# EasyEDA schematic PMD_PROJECT_var2.json
TITLE: 8086; REV: 1.0; Date: 2023-11-04; Sheet: 1/1; Company: Turcin
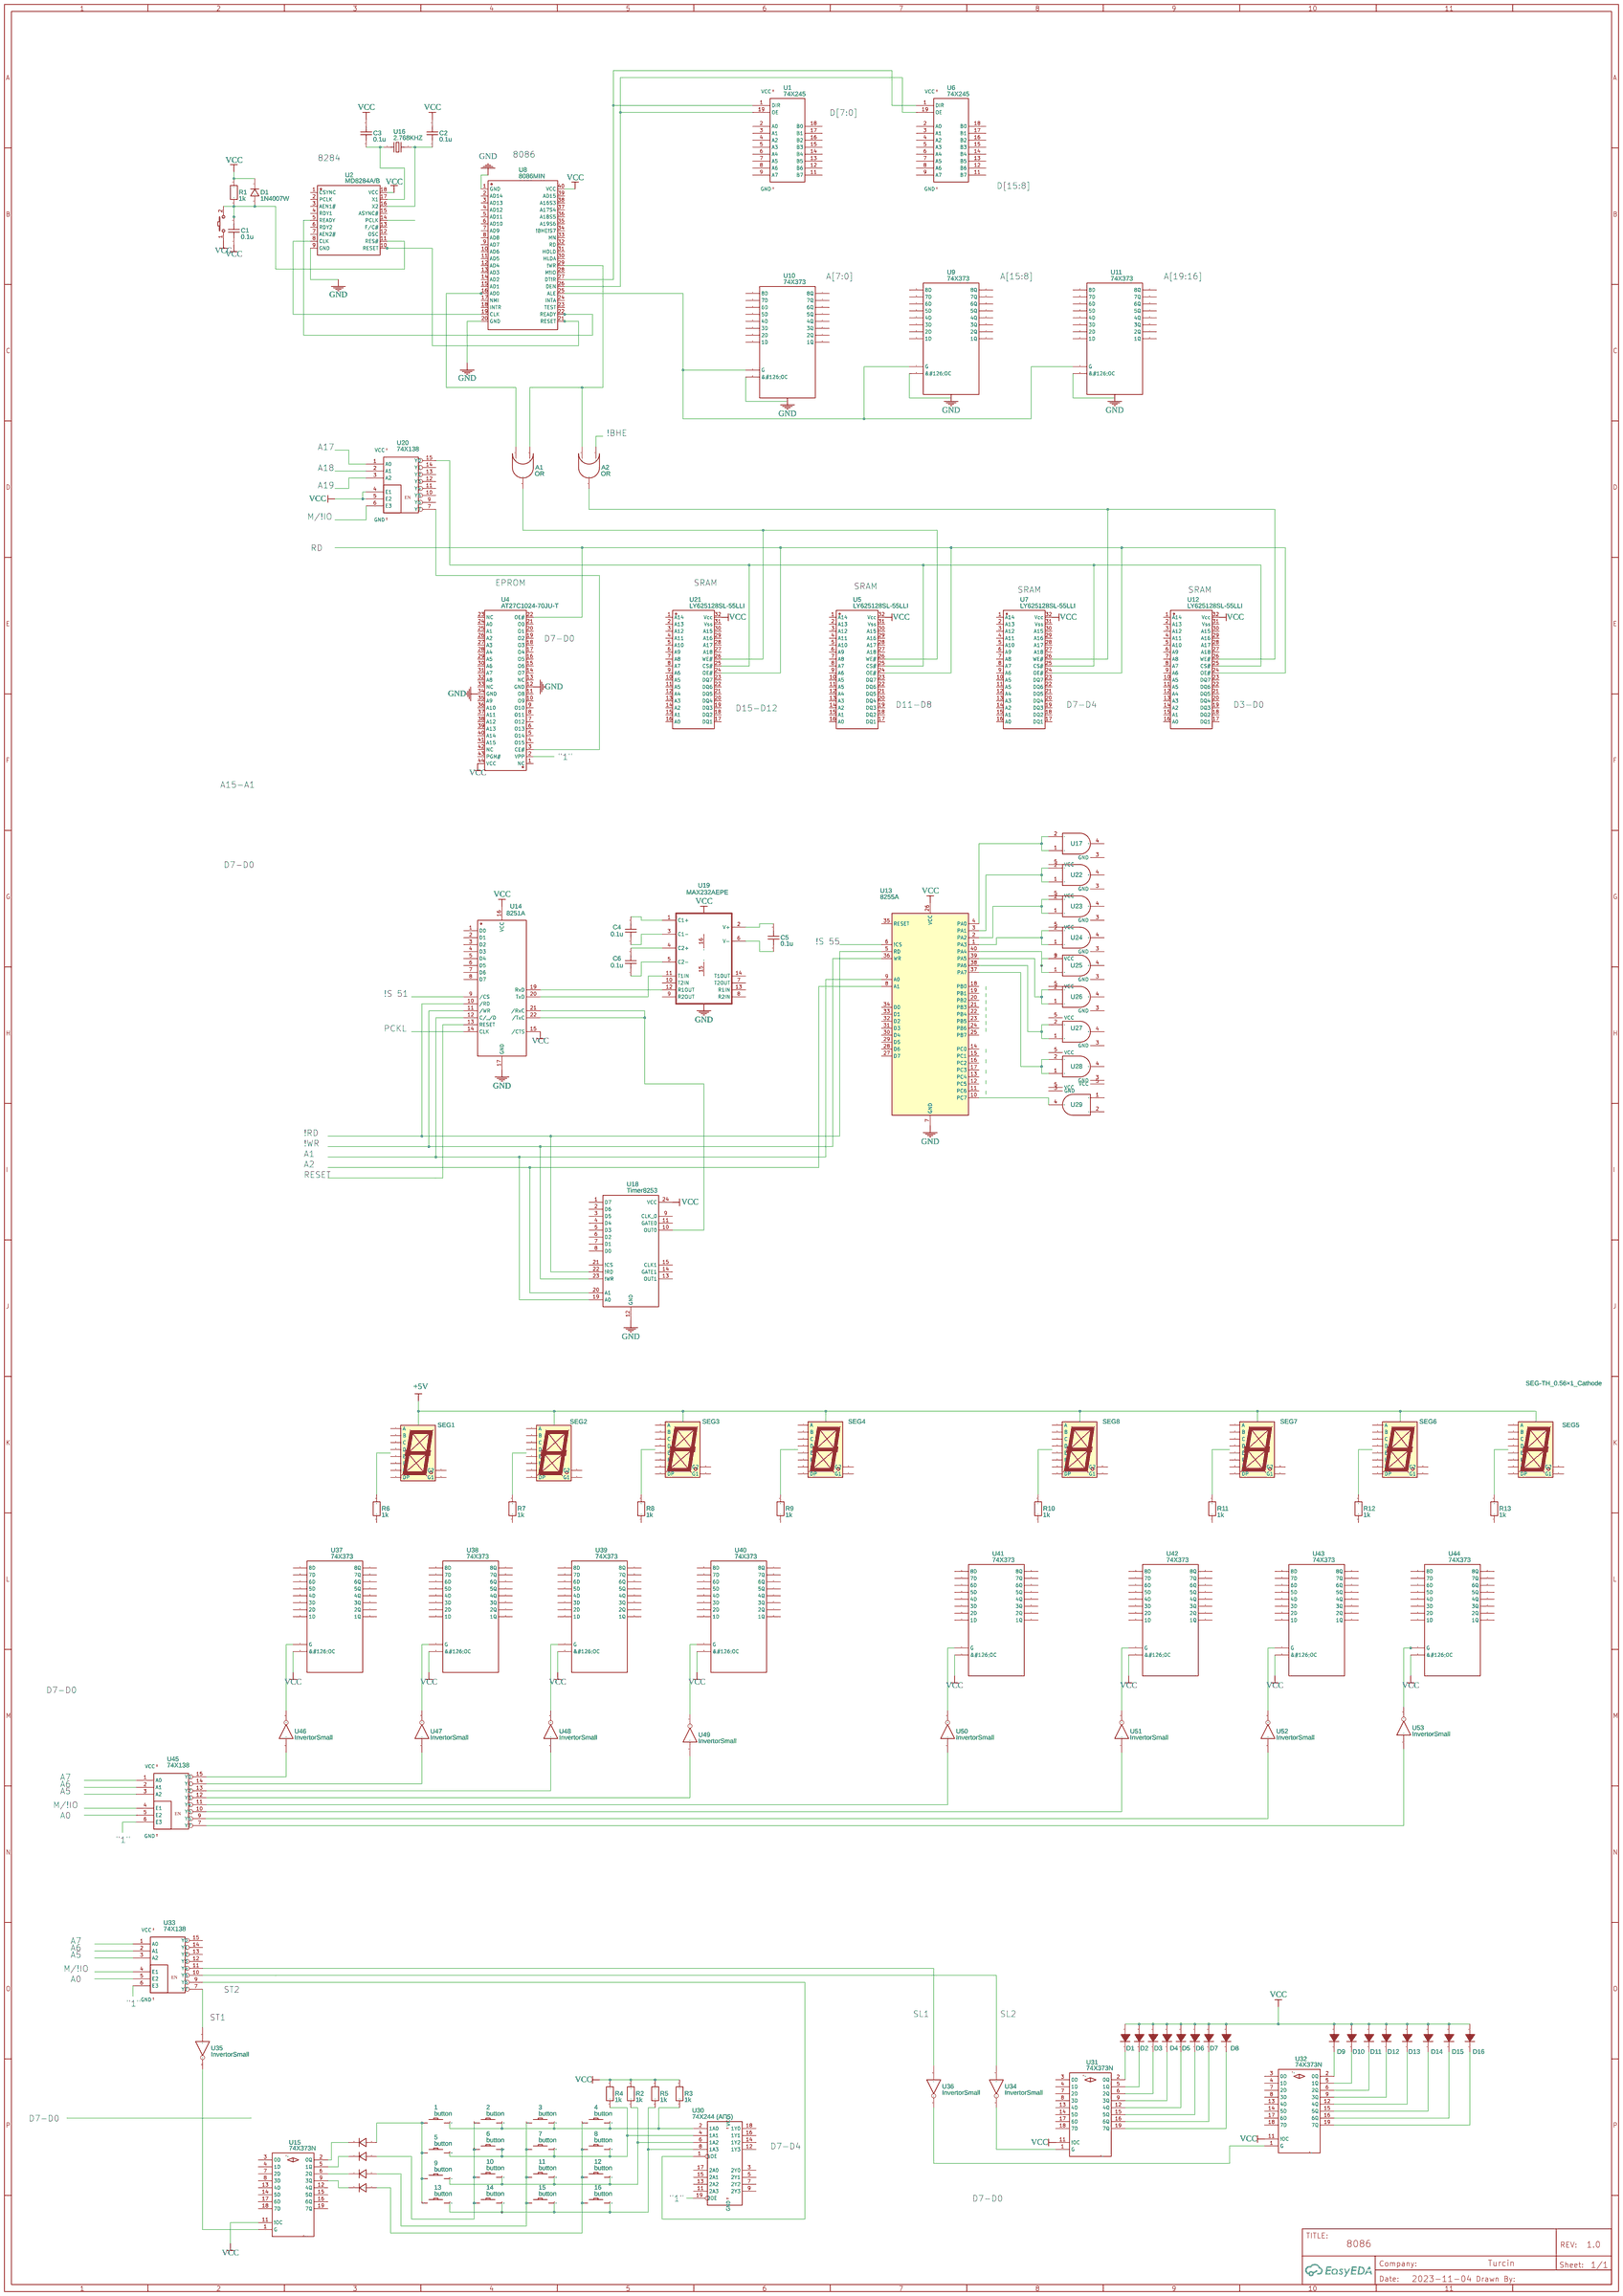
[diagram p0: schematic sheet]

## Parts
1  button  [32TEETH---CONDUCTIVE-BUTTONS_CONDUCTIVE_BUTTON_DIRECTIONAL_THICK]
2  button  [32TEETH---CONDUCTIVE-BUTTONS_CONDUCTIVE_BUTTON_DIRECTIONAL_THICK]
3  button  [32TEETH---CONDUCTIVE-BUTTONS_CONDUCTIVE_BUTTON_DIRECTIONAL_THICK]
4  button  [32TEETH---CONDUCTIVE-BUTTONS_CONDUCTIVE_BUTTON_DIRECTIONAL_THICK]
5  button  [32TEETH---CONDUCTIVE-BUTTONS_CONDUCTIVE_BUTTON_DIRECTIONAL_THICK]
6  button  [32TEETH---CONDUCTIVE-BUTTONS_CONDUCTIVE_BUTTON_DIRECTIONAL_THICK]
7  button  [32TEETH---CONDUCTIVE-BUTTONS_CONDUCTIVE_BUTTON_DIRECTIONAL_THICK]
8  button  [32TEETH---CONDUCTIVE-BUTTONS_CONDUCTIVE_BUTTON_DIRECTIONAL_THICK]
9  button  [32TEETH---CONDUCTIVE-BUTTONS_CONDUCTIVE_BUTTON_DIRECTIONAL_THICK]
10  button  [32TEETH---CONDUCTIVE-BUTTONS_CONDUCTIVE_BUTTON_DIRECTIONAL_THICK]
11  button  [32TEETH---CONDUCTIVE-BUTTONS_CONDUCTIVE_BUTTON_DIRECTIONAL_THICK]
12  button  [32TEETH---CONDUCTIVE-BUTTONS_CONDUCTIVE_BUTTON_DIRECTIONAL_THICK]
13  button  [32TEETH---CONDUCTIVE-BUTTONS_CONDUCTIVE_BUTTON_DIRECTIONAL_THICK]
14  button  [32TEETH---CONDUCTIVE-BUTTONS_CONDUCTIVE_BUTTON_DIRECTIONAL_THICK]
15  button  [32TEETH---CONDUCTIVE-BUTTONS_CONDUCTIVE_BUTTON_DIRECTIONAL_THICK]
16  button  [32TEETH---CONDUCTIVE-BUTTONS_CONDUCTIVE_BUTTON_DIRECTIONAL_THICK]
A1  OR
A2  OR
C1  0.1u  [C0603]
C2  0.1u  [C0603]
C3  0.1u  [C0603]
C4  0.1u  [C0603]
C5  0.1u  [C0603]
C6  0.1u  [C0603]
D1  1N4007W  [SOD-123_L2.8-W1.8-LS3.7-RD]
D1#2  diode led  [DO-41 (1N4007)_BD2.4-L4.7-P8.70-D0.9-RD]
D2  1N4007W  [SOD-123_L2.8-W1.8-LS3.7-RD]
D2#2  diode led  [DO-41 (1N4007)_BD2.4-L4.7-P8.70-D0.9-RD]
D3  1N4007W  [SOD-123_L2.8-W1.8-LS3.7-RD]
D3#2  diode led  [DO-41 (1N4007)_BD2.4-L4.7-P8.70-D0.9-RD]
D4  1N4007W  [SOD-123_L2.8-W1.8-LS3.7-RD]
D4#2  diode led  [DO-41 (1N4007)_BD2.4-L4.7-P8.70-D0.9-RD]
D5  1N4007W  [SOD-123_L2.8-W1.8-LS3.7-RD]
D5#2  diode led  [DO-41 (1N4007)_BD2.4-L4.7-P8.70-D0.9-RD]
D6  diode led  [DO-41 (1N4007)_BD2.4-L4.7-P8.70-D0.9-RD]
D7  diode led  [DO-41 (1N4007)_BD2.4-L4.7-P8.70-D0.9-RD]
D8  diode led  [DO-41 (1N4007)_BD2.4-L4.7-P8.70-D0.9-RD]
D9  diode led  [DO-41 (1N4007)_BD2.4-L4.7-P8.70-D0.9-RD]
D10  diode led  [DO-41 (1N4007)_BD2.4-L4.7-P8.70-D0.9-RD]
D11  diode led  [DO-41 (1N4007)_BD2.4-L4.7-P8.70-D0.9-RD]
D12  diode led  [DO-41 (1N4007)_BD2.4-L4.7-P8.70-D0.9-RD]
D13  diode led  [DO-41 (1N4007)_BD2.4-L4.7-P8.70-D0.9-RD]
D14  diode led  [DO-41 (1N4007)_BD2.4-L4.7-P8.70-D0.9-RD]
D15  diode led  [DO-41 (1N4007)_BD2.4-L4.7-P8.70-D0.9-RD]
D16  diode led  [DO-41 (1N4007)_BD2.4-L4.7-P8.70-D0.9-RD]
KEY1  K2-3.6×6.1_SMD  [KEY-SMD_2P-L6.2-W3.6-LS8.0]
R1  1k  [R0603]
R2  1k  [R0603]
R3  1k  [R0603]
R4  1k  [R0603]
R5  1k  [R0603]
R6  1k  [R0603]
R7  1k  [R0603]
R8  1k  [R0603]
R9  1k  [R0603]
R10  1k  [R0603]
R11  1k  [R0603]
R12  1k  [R0603]
R13  1k  [R0603]
SEG1  SEG-TH_0.56×1_Cathode  [LED-SEG-TH_10P-L12.6-W19.0-P2.54-S15.24-BL]
SEG2  SEG-TH_0.56×1_Cathode  [LED-SEG-TH_10P-L12.6-W19.0-P2.54-S15.24-BL]
SEG3  SEG-TH_0.56×1_Cathode  [LED-SEG-TH_10P-L12.6-W19.0-P2.54-S15.24-BL]
SEG4  SEG-TH_0.56×1_Cathode  [LED-SEG-TH_10P-L12.6-W19.0-P2.54-S15.24-BL]
SEG5  SEG-TH_0.56×1_Cathode  [LED-SEG-TH_10P-L12.6-W19.0-P2.54-S15.24-BL]
SEG6  SEG-TH_0.56×1_Cathode  [LED-SEG-TH_10P-L12.6-W19.0-P2.54-S15.24-BL]
SEG7  SEG-TH_0.56×1_Cathode  [LED-SEG-TH_10P-L12.6-W19.0-P2.54-S15.24-BL]
SEG8  SEG-TH_0.56×1_Cathode  [LED-SEG-TH_10P-L12.6-W19.0-P2.54-S15.24-BL]
U1  74X245  [IC20]
U2  MD8284A/B  [CDIP-18_L24.4-W6.5-P2.54-LS7.6-BL]
U4  AT27C1024-70JU-T  [PLCC-44_L16.6-W16.6-P1.27-LS17.5-T]
U5  LY625128SL-55LLI  [SOP-32_L20.7-W11.3-P1.27-LS14.1-BL]
U6  74X245  [IC20]
U7  LY625128SL-55LLI  [SOP-32_L20.7-W11.3-P1.27-LS14.1-BL]
U8  8086MIN  [DIP40]
U9  74X373
U10  74X373
U11  74X373
U12  LY625128SL-55LLI  [SOP-32_L20.7-W11.3-P1.27-LS14.1-BL]
U13  8255A  [DIP-40_W15.24MM]
U14  8251A  [COMM-TH_CTM8251AT]
U15  74X373N  [DIP20]
U16  2.768KHZ  [CRYSTAL-SMD_L3.2-W1.5-1]
U17  HD74LV1G08AVS  [PUSN0005KA-A]
U18  Timer8253  [DIP-24__600]
U19  MAX232AEPE  [DIP-16_L20.0-W6.4-P2.54-LS7.6-BL]
U20  74X138  [IC16]
U21  LY625128SL-55LLI  [SOP-32_L20.7-W11.3-P1.27-LS14.1-BL]
U22  HD74LV1G08AVS  [PUSN0005KA-A]
U23  HD74LV1G08AVS  [PUSN0005KA-A]
U24  HD74LV1G08AVS  [PUSN0005KA-A]
U25  HD74LV1G08AVS  [PUSN0005KA-A]
U26  HD74LV1G08AVS  [PUSN0005KA-A]
U27  HD74LV1G08AVS  [PUSN0005KA-A]
U28  HD74LV1G08AVS  [PUSN0005KA-A]
U29  HD74LV1G08AVS  [PUSN0005KA-A]
U30  74X244 (АП5)  [DIP20]
U31  74X373N  [DIP20]
U32  74X373N  [DIP20]
U33  74X138  [IC16]
U34  InvertorSmall
U35  InvertorSmall
U36  InvertorSmall
U37  74X373
U38  74X373
U39  74X373
U40  74X373
U41  74X373
U42  74X373
U43  74X373
U44  74X373
U45  74X138  [IC16]
U46  InvertorSmall
U47  InvertorSmall
U48  InvertorSmall
U49  InvertorSmall
U50  InvertorSmall
U51  InvertorSmall
U52  InvertorSmall
U53  InvertorSmall

## Library data of the parts
1-16 = button: Contributor: LorenzoVonMatterhorn
A1 A2 = OR: Contributor: Marco Micheletto
C1-C6 = C_0603_US: Contributor: LCEDA_Lib
D1-D5 = 1N4007W: Supplier: LCSC; Supplier Part: C328592; Manufacturer: BLUE ROCKET; Contributor: LCEDA_Lib
D1#2 D2#2 D3#2 D4#2 D5#2 D6-D16 = diode led: Manufacturer: ST(先科); Manufacturer Part: 1N4007; Supplier Part: C106903; JLCPCB Part Class: Extended Part; Contributor: remnow99
KEY1 = K2-3.6×6.1_SMD: Supplier Part: C118141; Supplier: LCSC; Manufacturer Part: K2-1107ST-A4SW-06; Contributor: LCEDA_Lib; 制造商: 韩国韩荣
R1-R13 = R_0603_EU: Contributor: LCEDA_Lib
SEG1-SEG8 = SEG-TH_0.56×1_Cathode: Manufacturer: 志浩; Supplier Part: C8093; Contributor: LCEDA_01
U1 U6 = 74X245: Contributor: KiCad
U2 = MD8284A/B: Contributor: lcsc; Supplier: LCSC; Supplier Part: C3610662; Manufacturer: 罗彻斯特; link: https://lcsc.com/eda_search?q=C3610662&%26type=1&ref=editor
U4 = AT27C1024-70JU-T: Contributor: LCSC; Supplier: LCSC; Supplier Part: C2061096; Manufacturer: MICROCHIP(美国微芯); JLCPCB Part Class: Extended Part; link: https://lcsc.com/eda_search?q=C2061096&%26type=1&ref=editor
U5 U7 U12 U21 = LY625128SL-55LLI: Contributor: LCSC; Supplier: LCSC; Supplier Part: C261870; Manufacturer: Lyontek(来扬); JLCPCB Part Class: Extended Part; link: https://lcsc.com/eda_search?q=C261870&%26type=1&ref=editor
U8 = 8086MIN
U9-U11 U37-U44 = 74X373: Contributor: ioana
U13 = 8255A: Contributor: Aptoime TV
U14 = 8251A: Supplier: LCSC; Supplier Part: C404254; Manufacturer: Tsiko; Manufacturer Part: CTM8251AT; Contributor: Cristina Nicolae
U15 U31 U32 = 74X373N: Octal Transparent Latch with 3-State Outputs; Manufacturer Part: 74X373; Contributor: mircioaga iulia
U16 = 2.768KHZ: Contributor: lcsc; Supplier: LCSC; Supplier Part: C9900022434; Manufacturer: null; Manufacturer Part: 2.768KHz; JLCPCB Part Class: Extended Part; link: https://lcsc.com/eda_search?q=C9900022434&%26type=1&ref=editor
U17 U22-U29 = HD74LV1G08AVS: 2-Input AND Gate
U18 = Timer8253: Supplier Part: P8253; Manufacturer: INTEL; Manufacturer Part: P8253; Contributor: Radu_matei; link: https://pdf1.alldatasheet.com/datasheet-pdf/view/66100/INTEL/P8253.html
U19 = MAX232AEPE: Supplier: LCSC; Manufacturer: MAXIM; Supplier Part: C9942; link: https://lcsc.com/eda_search?q=C9942&%26type=1&ref=editor
U20 U33 U45 = 74X138: Contributor: KiCad
U30 = 74X244 (АП5): Contributor: KiCad
U34-U36 U46-U53 = LOGIC: Contributor: Bilal Khan; sim: true

## Nets
GND: U2.9(GND) U4.12(GND) U4.34(GND) U8.1(GND) U8.20(GND) U13.7(GND) U14.17(GND) U18.12(GND)
VCC: C1.1 C2.2 C3.2 D1.1 D1#2.1(A) D2#2.1(A) D3#2.1(A) D4#2.1(A) D5#2.1(A) D6.1(A) D7.1(A) D8.1(A) D9.1(A) D10.1(A) D11.1(A) D12.1(A) D13.1(A) D14.1(A) D15.1(A) D16.1(A) KEY1.1 R1.2 R2.2 R3.2 R4.2 R5.2 U2.18(VCC) U4.44(VCC) U5.32(Vcc) U7.32(Vcc) U8.40(VCC) U12.32(Vcc) U13.26(VCC) U14.15(/CTS) U14.16(VCC) U15.11(!OC) U18.24(VCC) U20.4(E1) U20.5(E2) U21.32(Vcc) U31.11(!OC) U32.11(!OC) U37.18(&#126;OC) U38.18(&#126;OC) U39.18(&#126;OC) U40.18(&#126;OC) U41.18(&#126;OC) U42.18(&#126;OC) U43.18(&#126;OC) U44.18(&#126;OC)
Net-(1-P$ACTIVE): 1.P$ACTIVE 2.P$ACTIVE 3.P$ACTIVE 4.P$ACTIVE R3.1 U30.2(1A0)
Net-(1-P$GND): 1.P$GND 5.P$GND 9.P$GND 13.P$GND D2.2
Net-(2-P$GND): 2.P$GND 6.P$GND 10.P$GND 14.P$GND D3.2
Net-(3-P$GND): 3.P$GND 7.P$GND 11.P$GND 15.P$GND D4.2
Net-(4-P$GND): 4.P$GND 8.P$GND 12.P$GND 16.P$GND D5.2
Net-(5-P$ACTIVE): 5.P$ACTIVE 6.P$ACTIVE 7.P$ACTIVE 8.P$ACTIVE R4.1 U30.4(1A1)
Net-(9-P$ACTIVE): 9.P$ACTIVE 10.P$ACTIVE 11.P$ACTIVE 12.P$ACTIVE R2.1 U30.6(1A2)
Net-(13-P$ACTIVE): 13.P$ACTIVE 14.P$ACTIVE 15.P$ACTIVE 16.P$ACTIVE R5.1 U30.8(1A3)
Net-(A1-1): A1.1 A2.2 U8.29(!WR)
Net-(A1-2): A1.2 U8.16(AD0)
Net-(A1-3): A1.3 U5.26(WE#) U21.26(WE#)
Net-(A2-3): A2.3 U7.26(WE#) U12.26(WE#)
Net-(C1-2): C1.2 D1.2 KEY1.2 R1.1 U2.11(RES#)
Net-(C2-1): C2.1 U2.16(X2) U16.2
Net-(C3-1): C3.1 U2.17(X1) U16.1
Net-(C4-1): C4.1 U19.3(C1-)
Net-(C4-2): C4.2 U19.1(C1+)
Net-(C5-1): C5.1 U19.6(V-)
Net-(C5-2): C5.2 U19.2(V+)
Net-(C6-1): C6.1 U19.5(C2-)
Net-(C6-2): C6.2 U19.4(C2+)
Net-(D1#2-2): D1#2.2(K) U31.2(0Q)
Net-(D2#2-2): D2#2.2(K) U31.5(1Q)
Net-(D2-1): D2.1 U15.2(0Q)
Net-(D3#2-2): D3#2.2(K) U31.6(2Q)
Net-(D3-1): D3.1 U15.5(1Q)
Net-(D4#2-2): D4#2.2(K) U31.9(3Q)
Net-(D4-1): D4.1 U15.6(2Q)
Net-(D5#2-2): D5#2.2(K) U31.12(4Q)
Net-(D5-1): D5.1 U15.9(3Q)
Net-(D6-2): D6.2(K) U31.15(5Q)
Net-(D7-2): D7.2(K) U31.16(6Q)
Net-(D8-2): D8.2(K) U31.19(7Q)
Net-(D9-2): D9.2(K) U32.9(3Q)
Net-(D10-2): D10.2(K) U32.12(4Q)
Net-(D11-2): D11.2(K) U32.15(5Q)
Net-(D12-2): D12.2(K) U32.16(6Q)
Net-(D13-2): D13.2(K) U32.19(7Q)
Net-(D14-2): D14.2(K) U32.5(1Q)
Net-(D15-2): D15.2(K) U32.6(2Q)
Net-(D16-2): D16.2(K) U32.2(0Q)
Net-(U1-1): U1.1(DIR) U6.1(DIR) U8.27(DT!R)
Net-(U1-19): U1.19(OE) U6.19(OE) U8.26(DEN)
Net-(U2-5): U2.5(READY) U8.22(READY)
Net-(U2-8): U2.8(CLK) U8.19(CLK)
Net-(U2-10): U2.10(RESET) U8.21(RESET)
Net-(U4-3): U4.3(CE#) U20.7(Y7)
Net-(U4-22): U4.22(OE#) U5.24(OE#) U7.24(OE#) U12.24(OE#) U21.24(OE#)
Net-(U5-25): U5.25(CS#) U7.25(CS#) U12.25(CS#) U20.15(Y0) U21.25(CS#)
Net-(U8-25): U8.25(ALE) U9.17(G) U10.17(G) U11.17(G)
Net-(U13-1): U13.1(PA3) U24.1(IN B) U24.2(IN A)
Net-(U13-2): U13.2(PA2) U23.1(IN B) U23.2(IN A)
Net-(U13-3): U13.3(PA1) U22.1(IN B) U22.2(IN A)
Net-(U13-4): U13.4(PA0) U17.1(IN B) U17.2(IN A)
Net-(U13-5): U13.5(RD) U14.10(/RD) U18.22(!RD)
Net-(U13-8): U13.8(A1) U18.20(A1)
Net-(U13-9): U13.9(A0) U14.12(C/ /D) U18.19(A0)
Net-(U13-10): U13.10(PC7) U29.4(OUT Y)
Net-(U13-36): U13.36(WR) U14.11(/WR) U18.23(!WR)
Net-(U13-37): U13.37(PA7) U28.1(IN B) U28.2(IN A)
Net-(U13-38): U13.38(PA6) U27.1(IN B) U27.2(IN A)
Net-(U13-39): U13.39(PA5) U26.1(IN B) U26.2(IN A)
Net-(U13-40): U13.40(PA4) U24.5(VCC) U25.1(IN B) U25.2(IN A)
Net-(U14-19): U14.19(RxD) U19.12(R1OUT)
Net-(U14-20): U14.20(TxD) U19.11(T1IN)
Net-(U14-21): U14.21(/RxC) U14.22(/TxC) U18.10(OUT0)
Net-(U15-1): U15.1(G) U35.8(1)
Net-(U30-1): U30.1(1OE) U33.9(Y6)
Net-(U31-1): U31.1(G) U34.8(1)
Net-(U32-1): U32.1(G) U36.8(1)
Net-(U33-7): U33.7(Y7) U35.9(2)
Net-(U33-10): U33.10(Y5) U34.9(2)
Net-(U33-11): U33.11(Y4) U36.9(2)
Net-(U37-17): U37.17(G) U46.8(1)
Net-(U38-17): U38.17(G) U47.8(1)
Net-(U39-17): U39.17(G) U48.8(1)
Net-(U40-17): U40.17(G) U49.8(1)
Net-(U41-17): U41.17(G) U50.8(1)
Net-(U42-17): U42.17(G) U51.8(1)
Net-(U43-17): U43.17(G) U52.8(1)
Net-(U44-17): U44.17(G) U53.8(1)
Net-(U45-7): U45.7(Y7) U53.9(2)
Net-(U45-9): U45.9(Y6) U52.9(2)
Net-(U45-10): U45.10(Y5) U51.9(2)
Net-(U45-11): U45.11(Y4) U50.9(2)
Net-(U45-12): U45.12(Y3) U49.9(2)
Net-(U45-13): U45.13(Y2) U48.9(2)
Net-(U45-14): U45.14(Y1) U47.9(2)
Net-(U45-15): U45.15(Y0) U46.9(2)

Not connected (* = marked no-connect by the designer): A2 1; R6 1 2; R7 1 2; R8 1 2; R9 1 2; R10 1 2; R11 1 2; R12 1 2; R13 1 2; SEG1 1(E) 2(D) 3(G1) 4(C) 5(DP) 6(B) 7(A) 8(G2) 9(F) 10(G); SEG2 1(E) 2(D) 3(G1) 4(C) 5(DP) 6(B) 7(A) 8(G2) 9(F) 10(G); SEG3 1(E) 2(D) 3(G1) 4(C) 5(DP) 6(B) 7(A) 8(G2) 9(F) 10(G); SEG4 1(E) 2(D) 3(G1) 4(C) 5(DP) 6(B) 7(A) 8(G2) 9(F) 10(G); SEG5 1(E) 2(D) 3(G1) 4(C) 5(DP) 6(B) 7(A) 8(G2) 9(F) 10(G); SEG6 1(E) 2(D) 3(G1) 4(C) 5(DP) 6(B) 7(A) 8(G2) 9(F) 10(G); SEG7 1(E) 2(D) 3(G1) 4(C) 5(DP) 6(B) 7(A) 8(G2) 9(F) 10(G); SEG8 1(E) 2(D) 3(G1) 4(C) 5(DP) 6(B) 7(A) 8(G2) 9(F) 10(G); U1 2(A0) 3(A1) 4(A2) 5(A3) 6(A4) 7(A5) 8(A6) 9(A7) 10(GND) 11(B7) 12(B6) 13(B5) 14(B4) 15(B3) 16(B2) 17(B1) 18(B0) 20(VCC); U2 1(CSYNC) 2(PCLK) 3(AEN1#) 4(RDY1) 6(RDY2) 7(AEN2#) 12(OSC) 13(F/C#) 14(PCLK) 15(ASYNC#); U4 1(NC) 2(VPP) 4(O15) 5(O14) 6(O13) 7(O12) 8(O11) 9(O10) 10(O9) 11(O8) 13(NC) 14(O7) 15(O6) 16(O5) 17(O4) 18(O3) 19(O2) 20(O1) 21(O0) 23(NC) 24(A0) 25(A1) 26(A2) 27(A3) 28(A4) 29(A5) 30(A6) 31(A7) 32(A8) 33(NC) 35(A9) 36(A10) 37(A11) 38(A12) 39(A13) 40(A14) 41(A15) 42(NC) 43(PGM#); U5 1(A14) 2(A13) 3(A12) 4(A11) 5(A10) 6(A9) 7(A8) 8(A7) 9(A6) 10(A5) 11(A5) 12(A4) 13(A3) 14(A2) 15(A1) 16(A0) 17(DQ1) 18(DQ2) 19(DQ3) 20(DQ4) 21(DQ5) 22(DQ6) 23(DQ7) 27(A18) 28(A17) 29(A16) 30(A15) 31(Vss); U6 2(A0) 3(A1) 4(A2) 5(A3) 6(A4) 7(A5) 8(A6) 9(A7) 10(GND) 11(B7) 12(B6) 13(B5) 14(B4) 15(B3) 16(B2) 17(B1) 18(B0) 20(VCC); U7 1(A14) 2(A13) 3(A12) 4(A11) 5(A10) 6(A9) 7(A8) 8(A7) 9(A6) 10(A5) 11(A5) 12(A4) 13(A3) 14(A2) 15(A1) 16(A0) 17(DQ1) 18(DQ2) 19(DQ3) 20(DQ4) 21(DQ5) 22(DQ6) 23(DQ7) 27(A18) 28(A17) 29(A16) 30(A15) 31(Vss); U8 2(AD14) 3(AD13) 4(AD12) 5(AD11) 6(AD10) 7(AD9) 8(AD8) 9(AD7) 10(AD6) 11(AD5) 12(AD4) 13(AD3) 14(AD2) 15(AD1) 17(NMI) 18(INTR) 23(TEST) 24(INTA) 28(M!IO) 30(HLDA) 31(HOLD) 32(RD) 33(MN) 34(!BHE!S7) 35(A19S6) 36(A18S5) 37(A17S4) 38(A16S3) 39(AD15); U9 1(8Q) 2(7Q) 3(6Q) 4(5Q) 5(4Q) 6(3Q) 7(2Q) 8(1Q) 9(8D) 10(7D) 11(6D) 12(5D) 13(4D) 14(3D) 15(2D) 16(1D) 18(&#126;OC); U10 1(8Q) 2(7Q) 3(6Q) 4(5Q) 5(4Q) 6(3Q) 7(2Q) 8(1Q) 9(8D) 10(7D) 11(6D) 12(5D) 13(4D) 14(3D) 15(2D) 16(1D) 18(&#126;OC); U11 1(8Q) 2(7Q) 3(6Q) 4(5Q) 5(4Q) 6(3Q) 7(2Q) 8(1Q) 9(8D) 10(7D) 11(6D) 12(5D) 13(4D) 14(3D) 15(2D) 16(1D) 18(&#126;OC); U12 1(A14) 2(A13) 3(A12) 4(A11) 5(A10) 6(A9) 7(A8) 8(A7) 9(A6) 10(A5) 11(A5) 12(A4) 13(A3) 14(A2) 15(A1) 16(A0) 17(DQ1) 18(DQ2) 19(DQ3) 20(DQ4) 21(DQ5) 22(DQ6) 23(DQ7) 27(A18) 28(A17) 29(A16) 30(A15) 31(Vss); U13 6(!CS) 11(PC6) 12(PC5) 13(PC4) 14(PC0) 15(PC1) 16(PC2) 17(PC3) 18(PB0) 19(PB1) 20(PB2) 21(PB3) 22(PB4) 23(PB5) 24(PB6) 25(PB7) 27(D7) 28(D6) 29(D5) 30(D4) 31(D3) 32(D2) 33(D1) 34(D0) 35(RESET); U14 1(D0) 2(D1) 3(D2) 4(D3) 5(D4) 6(D5) 7(D6) 8(D7) 9(/CS) 13(RESET) 14(CLK); U15 3(0D) 4(1D) 7(2D) 8(3D) 10(GND) 12(4Q) 13(4D) 14(5D) 15(5Q) 16(6Q) 17(6D) 18(7D) 19(7Q) 20(VCC); U17 3(GND) 4(OUT Y) 5(VCC); U18 1(D7) 2(D6) 3(D5) 4(D4) 5(D3) 6(D2) 7(D1) 8(D0) 9(CLK 0) 11(GATE0) 13(OUT1) 14(GATE1) 15(CLK1) 21(!CS); U19 7(T2OUT) 8(R2IN) 9(R2OUT) 10(T2IN) 13(R1IN) 14(T1OUT) 15(GND) 16(VCC); U20 1(A0) 2(A1) 3(A2) 6(E3) 8(GND) 9(Y6) 10(Y5) 11(Y4) 12(Y3) 13(Y2) 14(Y1) 16(VCC); U21 1(A14) 2(A13) 3(A12) 4(A11) 5(A10) 6(A9) 7(A8) 8(A7) 9(A6) 10(A5) 11(A5) 12(A4) 13(A3) 14(A2) 15(A1) 16(A0) 17(DQ1) 18(DQ2) 19(DQ3) 20(DQ4) 21(DQ5) 22(DQ6) 23(DQ7) 27(A18) 28(A17) 29(A16) 30(A15) 31(Vss); U22 3(GND) 4(OUT Y) 5(VCC); U23 3(GND) 4(OUT Y) 5(VCC); U24 3(GND) 4(OUT Y); U25 3(GND) 4(OUT Y) 5(VCC); U26 3(GND) 4(OUT Y) 5(VCC); U27 3(GND) 4(OUT Y) 5(VCC); U28 3(GND) 4(OUT Y) 5(VCC); U29 1(IN B) 2(IN A) 3(GND) 5(VCC); U30 3(2Y0) 5(2Y1) 7(2Y2) 9(2Y3) 10(GND) 11(2A3) 12(1Y3) 13(2A2) 14(1Y2) 15(2A1) 16(1Y1) 17(2A0) 18(1Y0) 19(2OE) 20(VCC); U31 3(0D) 4(1D) 7(2D) 8(3D) 10(GND) 13(4D) 14(5D) 17(6D) 18(7D) 20(VCC); U32 3(0D) 4(1D) 7(2D) 8(3D) 10(GND) 13(4D) 14(5D) 17(6D) 18(7D) 20(VCC); U33 1(A0) 2(A1) 3(A2) 4(E1) 5(E2) 6(E3) 8(GND) 12(Y3) 13(Y2) 14(Y1) 15(Y0) 16(VCC); U37 1(8Q) 2(7Q) 3(6Q) 4(5Q) 5(4Q) 6(3Q) 7(2Q) 8(1Q) 9(8D) 10(7D) 11(6D) 12(5D) 13(4D) 14(3D) 15(2D) 16(1D); U38 1(8Q) 2(7Q) 3(6Q) 4(5Q) 5(4Q) 6(3Q) 7(2Q) 8(1Q) 9(8D) 10(7D) 11(6D) 12(5D) 13(4D) 14(3D) 15(2D) 16(1D); U39 1(8Q) 2(7Q) 3(6Q) 4(5Q) 5(4Q) 6(3Q) 7(2Q) 8(1Q) 9(8D) 10(7D) 11(6D) 12(5D) 13(4D) 14(3D) 15(2D) 16(1D); U40 1(8Q) 2(7Q) 3(6Q) 4(5Q) 5(4Q) 6(3Q) 7(2Q) 8(1Q) 9(8D) 10(7D) 11(6D) 12(5D) 13(4D) 14(3D) 15(2D) 16(1D); U41 1(8Q) 2(7Q) 3(6Q) 4(5Q) 5(4Q) 6(3Q) 7(2Q) 8(1Q) 9(8D) 10(7D) 11(6D) 12(5D) 13(4D) 14(3D) 15(2D) 16(1D); U42 1(8Q) 2(7Q) 3(6Q) 4(5Q) 5(4Q) 6(3Q) 7(2Q) 8(1Q) 9(8D) 10(7D) 11(6D) 12(5D) 13(4D) 14(3D) 15(2D) 16(1D); U43 1(8Q) 2(7Q) 3(6Q) 4(5Q) 5(4Q) 6(3Q) 7(2Q) 8(1Q) 9(8D) 10(7D) 11(6D) 12(5D) 13(4D) 14(3D) 15(2D) 16(1D); U44 1(8Q) 2(7Q) 3(6Q) 4(5Q) 5(4Q) 6(3Q) 7(2Q) 8(1Q) 9(8D) 10(7D) 11(6D) 12(5D) 13(4D) 14(3D) 15(2D) 16(1D); U45 1(A0) 2(A1) 3(A2) 4(E1) 5(E2) 6(E3) 8(GND) 16(VCC)

## Notes on the sheet
- D[7:0]
- 8284
- 8086
- D[15:8]
- A[7:0]
- A[15:8]
- A[19:16]
- !BHE
- A17
- A18
- A19
- M/!IO
- RD
- EPROM
- SRAM
- SRAM
- SRAM
- SRAM
- D7-D0
- D15-D12
- D11-D8
- D7-D4
- D3-D0
- "1"
- A15-A1
- D7-D0
- !S 55
- !S 51
- PCKL
- !RD
- !WR
- A1
- A2
- RESET
- D7-D0
- A7
- A6
- A5
- M/!IO
- A0
- "1"
- A7
- A6
- A5
- M/!IO
- A0
- ST2
- "1"
- ST1
- SL1
- SL2
- D7-D0
- D7-D4
- "1"
- D7-D0
